# Altium schematic sheet Debug.SchDoc
size 420 x 297 mm; SheetNumber: 3; SheetTotal: 8
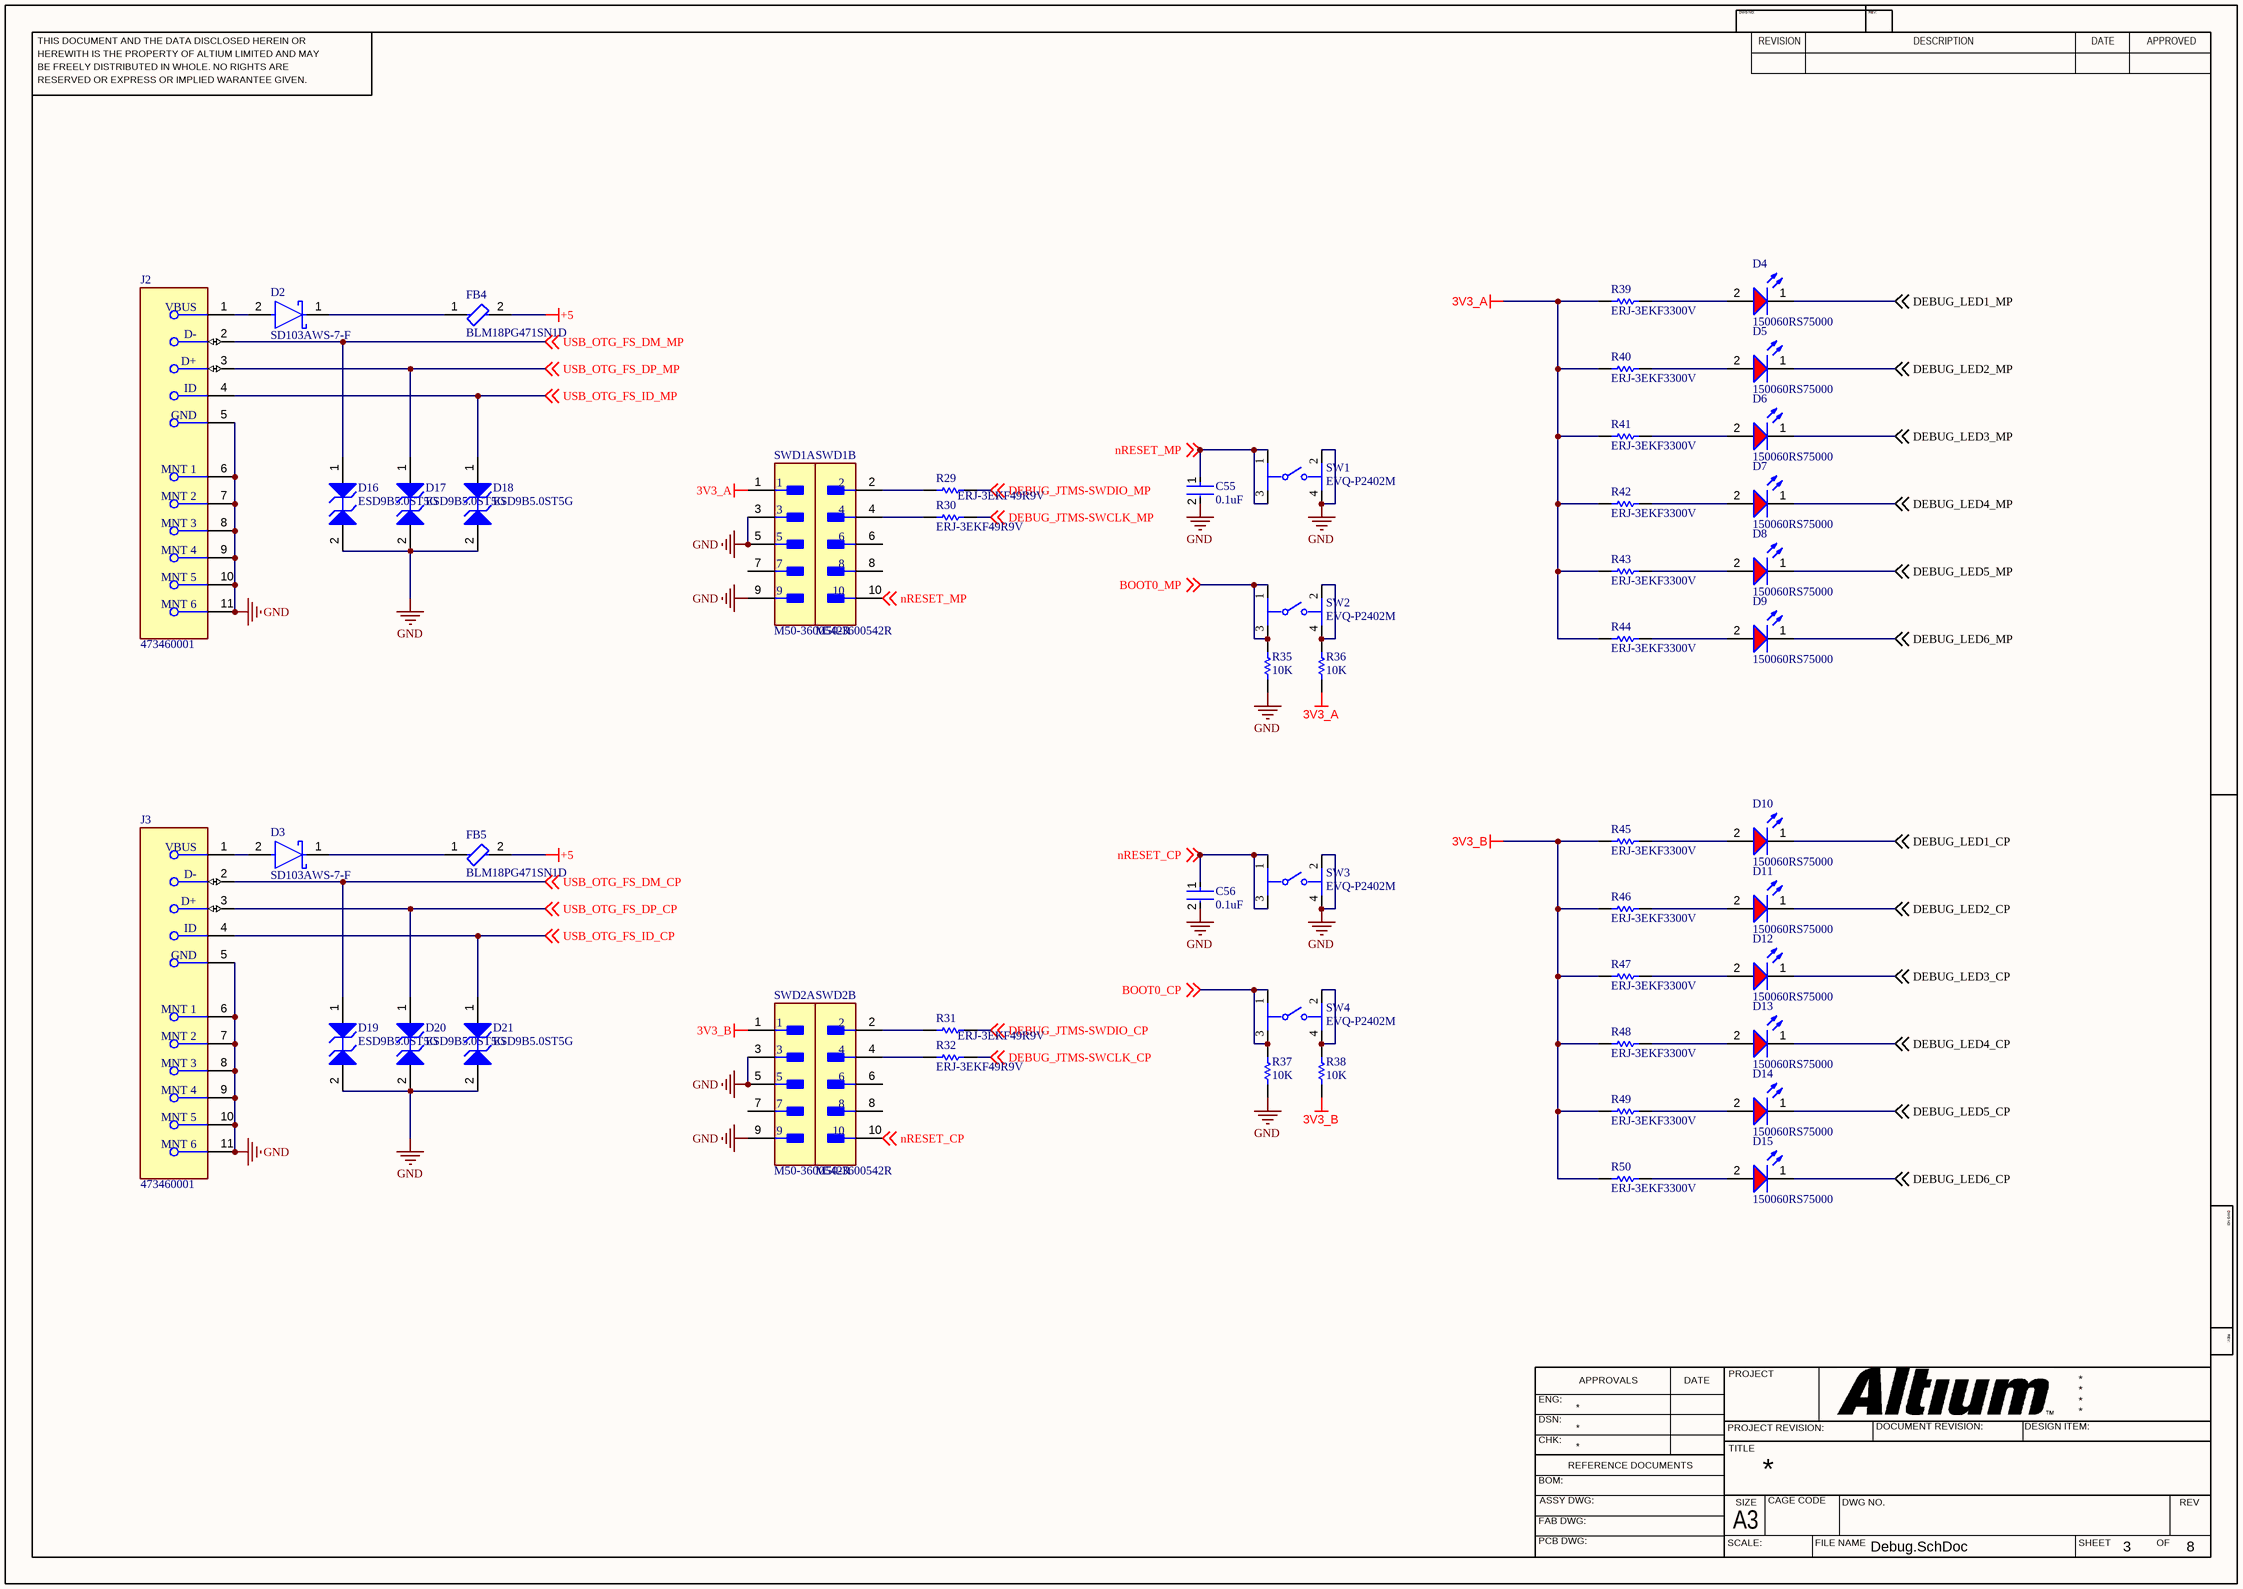
[diagram p0: Debug.SchDoc]

## Parts
C55  0.1uF  [FP-C0603C-CF-MFG]
C56  0.1uF  [FP-C0603C-CF-MFG]
D2  SD103AWS-7-F  [FP-SOD323-MFG]
D3  SD103AWS-7-F  [FP-SOD323-MFG]
D4  150060RS75000  [WL-SMCW_0603_150060xx75000]
D5  150060RS75000  [WL-SMCW_0603_150060xx75000]
D6  150060RS75000  [WL-SMCW_0603_150060xx75000]
D7  150060RS75000  [WL-SMCW_0603_150060xx75000]
D8  150060RS75000  [WL-SMCW_0603_150060xx75000]
D9  150060RS75000  [WL-SMCW_0603_150060xx75000]
D10  150060RS75000  [WL-SMCW_0603_150060xx75000]
D11  150060RS75000  [WL-SMCW_0603_150060xx75000]
D12  150060RS75000  [WL-SMCW_0603_150060xx75000]
D13  150060RS75000  [WL-SMCW_0603_150060xx75000]
D14  150060RS75000  [WL-SMCW_0603_150060xx75000]
D15  150060RS75000  [WL-SMCW_0603_150060xx75000]
D16  ESD9B5.0ST5G  [ONSC-SOD-923-2-514AB-01_V]
D17  ESD9B5.0ST5G  [ONSC-SOD-923-2-514AB-01_V]
D18  ESD9B5.0ST5G  [ONSC-SOD-923-2-514AB-01_V]
D19  ESD9B5.0ST5G  [ONSC-SOD-923-2-514AB-01_V]
D20  ESD9B5.0ST5G  [ONSC-SOD-923-2-514AB-01_V]
D21  ESD9B5.0ST5G  [ONSC-SOD-923-2-514AB-01_V]
FB4  BLM18PG471SN1D  [FP-BLM18-0_15-t0_8-MFG]
FB5  BLM18PG471SN1D  [FP-BLM18-0_15-t0_8-MFG]
J2  473460001  [FP-473460001-MFG]
J3  473460001  [FP-473460001-MFG]
R29  ERJ-3EKF49R9V  [RESC1608X55X30ML15T15]
R30  ERJ-3EKF49R9V  [RESC1608X55X30ML15T15]
R31  ERJ-3EKF49R9V  [RESC1608X55X30ML15T15]
R32  ERJ-3EKF49R9V  [RESC1608X55X30ML15T15]
R35  10K  [RESC1609X55X30LL15T15]
R36  10K  [RESC1609X55X30LL15T15]
R37  10K  [RESC1609X55X30LL15T15]
R38  10K  [RESC1609X55X30LL15T15]
R39  ERJ-3EKF3300V  [RESC1608X55X30LL15T15]
R40  ERJ-3EKF3300V  [RESC1608X55X30LL15T15]
R41  ERJ-3EKF3300V  [RESC1608X55X30LL15T15]
R42  ERJ-3EKF3300V  [RESC1608X55X30LL15T15]
R43  ERJ-3EKF3300V  [RESC1608X55X30LL15T15]
R44  ERJ-3EKF3300V  [RESC1608X55X30LL15T15]
R45  ERJ-3EKF3300V  [RESC1608X55X30LL15T15]
R46  ERJ-3EKF3300V  [RESC1608X55X30LL15T15]
R47  ERJ-3EKF3300V  [RESC1608X55X30LL15T15]
R48  ERJ-3EKF3300V  [RESC1608X55X30LL15T15]
R49  ERJ-3EKF3300V  [RESC1608X55X30LL15T15]
R50  ERJ-3EKF3300V  [RESC1608X55X30LL15T15]
SW1  EVQ-P2402M  [FP-EVQ-P2402M-MFG]
SW2  EVQ-P2402M  [FP-EVQ-P2402M-MFG]
SW3  EVQ-P2402M  [FP-EVQ-P2402M-MFG]
SW4  EVQ-P2402M  [FP-EVQ-P2402M-MFG]
SWD1  M50-3600542R  [FP-M50-3600542R-MFG]  (parts A,B of 2)
SWD2  M50-3600542R  [FP-M50-3600542R-MFG]  (parts A,B of 2)

## Nets
3V3_A: R36.1 R39.1 R40.1 R41.1 R42.1 R43.1 R44.1 SWD1.1
3V3_B: R38.1 R45.1 R46.1 R47.1 R48.1 R49.1 R50.1 SWD2.1
+5: FB4.2 FB5.2
GND: C55.2 C56.2 D16.2(A2) D17.2(A2) D18.2(A2) D19.2(A2) D20.2(A2) D21.2(A2) J2.5(GND) J2.6(MNT_1) J2.7(MNT_2) J2.8(MNT_3) J2.9(MNT_4) J2.10(MNT_5) J2.11(MNT_6) J3.5(GND) J3.6(MNT_1) J3.7(MNT_2) J3.8(MNT_3) J3.9(MNT_4) J3.10(MNT_5) J3.11(MNT_6) R35.1 R37.1 SW1.2 SW1.4 SW3.2 SW3.4 SWD1.3 SWD1.5 SWD1.9 SWD2.3 SWD2.5 SWD2.9
BOOT0_CP: R37.2 SW4.1 SW4.3 ; off-sheet BOOT0_CP
BOOT0_MP: R35.2 SW2.1 SW2.3 ; off-sheet BOOT0_MP
DEBUG_JTMS-SWCLK_CP: R32.2 ; off-sheet DEBUG_JTMS-SWCLK_CP
DEBUG_JTMS-SWCLK_MP: R30.2 ; off-sheet DEBUG_JTMS-SWCLK_MP
DEBUG_JTMS-SWDIO_CP: R31.2 ; off-sheet DEBUG_JTMS-SWDIO_CP
DEBUG_JTMS-SWDIO_MP: R29.2 ; off-sheet DEBUG_JTMS-SWDIO_MP
DEBUG_LED1_CP: D10.1(K) ; off-sheet DEBUG_LED1_CP
DEBUG_LED1_MP: D4.1(K) ; off-sheet DEBUG_LED1_MP
DEBUG_LED2_CP: D11.1(K) ; off-sheet DEBUG_LED2_CP
DEBUG_LED2_MP: D5.1(K) ; off-sheet DEBUG_LED2_MP
DEBUG_LED3_CP: D12.1(K) ; off-sheet DEBUG_LED3_CP
DEBUG_LED3_MP: D6.1(K) ; off-sheet DEBUG_LED3_MP
DEBUG_LED4_CP: D13.1(K) ; off-sheet DEBUG_LED4_CP
DEBUG_LED4_MP: D7.1(K) ; off-sheet DEBUG_LED4_MP
DEBUG_LED5_CP: D14.1(K) ; off-sheet DEBUG_LED5_CP
DEBUG_LED5_MP: D8.1(K) ; off-sheet DEBUG_LED5_MP
DEBUG_LED6_CP: D15.1(K) ; off-sheet DEBUG_LED6_CP
DEBUG_LED6_MP: D9.1(K) ; off-sheet DEBUG_LED6_MP
nRESET_CP: C56.1 SW3.1 SW3.3 SWD2.10 ; off-sheet nRESET_CP
nRESET_MP: C55.1 SW1.1 SW1.3 SWD1.10 ; off-sheet nRESET_MP
USB_OTG_FS_DM_CP: D19.1(A1) J3.2(D-) ; off-sheet USB_OTG_FS_DM_CP
USB_OTG_FS_DM_MP: D16.1(A1) J2.2(D-) ; off-sheet USB_OTG_FS_DM_MP
USB_OTG_FS_DP_CP: D20.1(A1) J3.3(D+) ; off-sheet USB_OTG_FS_DP_CP
USB_OTG_FS_DP_MP: D17.1(A1) J2.3(D+) ; off-sheet USB_OTG_FS_DP_MP
USB_OTG_FS_ID_CP: D21.1(A1) J3.4(ID) ; off-sheet USB_OTG_FS_ID_CP
USB_OTG_FS_ID_MP: D18.1(A1) J2.4(ID) ; off-sheet USB_OTG_FS_ID_MP
NetD2_1: D2.1(C) FB4.1
NetD2_2: D2.2(A) J2.1(VBUS)
NetD3_1: D3.1(C) FB5.1
NetD3_2: D3.2(A) J3.1(VBUS)
NetD4_2: D4.2(A) R39.2
NetD5_2: D5.2(A) R40.2
NetD6_2: D6.2(A) R41.2
NetD7_2: D7.2(A) R42.2
NetD8_2: D8.2(A) R43.2
NetD9_2: D9.2(A) R44.2
NetD10_2: D10.2(A) R45.2
NetD11_2: D11.2(A) R46.2
NetD12_2: D12.2(A) R47.2
NetD13_2: D13.2(A) R48.2
NetD14_2: D14.2(A) R49.2
NetD15_2: D15.2(A) R50.2
NetR29_1: R29.1 SWD1.2
NetR30_1: R30.1 SWD1.4
NetR31_1: R31.1 SWD2.2
NetR32_1: R32.1 SWD2.4
NetR36_2: R36.2 SW2.2 SW2.4
NetR38_2: R38.2 SW4.2 SW4.4

Not connected (* = marked no-connect by the designer): SWD1 6 7 8; SWD2 6 7 8

## Notes on the sheet
- THIS DOCUMENT AND THE DATA DISCLOSED HEREIN OR
- HEREWITH IS THE PROPERTY OF ALTIUM LIMITED AND MAY
- DWG NO:
- REVISION
- REV:
- DESCRIPTION
- DATE
- APPROVED
- BE FREELY DISTRIBUTED IN WHOLE. NO RIGHTS ARE
- RESERVED OR EXPRESS OR IMPLIED WARANTEE GIVEN.
- ENG:
- APPROVALS
- PROJECT
- DSN:
- CHK:
- REFERENCE DOCUMENTS
- PROJECT REVISION:
- TITLE
- DOCUMENT REVISION:
- DESIGN ITEM:
- BOM:
- FAB DWG:
- PCB DWG:
- ASSY DWG:
- SCALE:
- A3
- SIZE
- CAGE CODE
- FILE NAME
- DWG NO.
- SHEET
- OF
- REV

## Library data of the parts
C55 C56 = CMP-2006-03061-2: CAP CER 0.1UF 50V X7R 0603; Manufacturer: KEMET; Manufacturer Part Number: C0603C104K5RACTU; Tolerance: 0.1; Temperature Coefficient: 30ppm/°C; Material: Ceramic; Automotive Grade: Grade 1; Value: 0.10 μF; Temperature: -55°C to +125°C; RoHS: TRUE; Temperature Range High: +125°C; Lead Free: Yes; Octopart: https://octopart.com/c0603c104k5ractu-kemet-139244; Digikey Description: CAP CER 0.1UF 50V X7R 0603; Category: Cap; Package: C0603C-CF; ComponentLink2Description: Datasheet; Temperature Range Low: -55°C; Device Class L1: Passive Components; Voltage Rating: 50 V; Automotive: Yes; Device Class L3: Ceramic Capacitors; ComponentLink2URL: https://api.kemet.com/component-edge/download/datasheet/C0603C100J5GACAUTO.pdf; Capacitance: 0.10 μF; Device Class L2: Capacitors; Temperature Characteristic: X7R; Height: 0.87mm
D2 D3 = CMP-12790-000048-1: DIODE SCHOTTKY 40V 350MA SOD323; Manufacturer: Diodes Inc.; Max Surge Forward Current: 1.5A; Capacitance: 35pF; Peak Reverse Current: 5uA; Standoff Height: 0.05mm; Max Junction Temp: +125°C; Value: 35pF; Automotive Grade: Grade 1; ComponentLink2URL: https://www.diodes.com/assets/Datasheets/ds30101.pdf; Ipc Land Pattern Name: SOD250130X110-2; Octopart: https://octopart.com/sd103aws-7-f-diodes+inc.-55389602; Forward Current: 350mA; Device Class L1: Discrete Semiconductors; Lead Free: Yes; ComponentLink2Description: Datasheet; RoHS: TRUE; Temperature: -65°C to +125°C; Temperature Range Low: -65°C; Category: Diode; Package: SOD323; Digikey Description: DIODE SCHOTTKY 40V 350MA SOD323; Automotive: Yes; Device Class L2: Diodes; Mouser Description: Schottky Diodes & Rectifiers 40V 200mW; Manufacturer Part Number: SD103AWS-7-F; Device Class L3: Schottky Diodes; Max Repetitive Reverse Voltage: 40V; Footprint Url: https://www.diodes.com/assets/Package-Files/SOD323.pdf; Reverse Voltage: 40V; Temperature Range High: +125°C; Height: 1.2mm
D4-D15 = CMP-1426-00001-4: LED Low-Power Uni-Color Red 630nm 2V 2-Pin Chip 0603(1608Metric) T/R; Max Junction Temperature (Tj): 95°C; Dominant Wavelength: 625nm; Lens Style: Clear, Rectangular; Viewing Angle: 140°; Forward Current: 100mA; Max Reverse Voltage (DC): 5V; Luminous Intensity: 250mcd; Test Current: 20mA; Power Dissipation: 72mW; Max Operating Temperature: 85°C; Mount: Surface Mount; Height: 700µm; Packaging: Tape and Reel; REACH SVHC: Unknown; Case Code (Metric): 1608; Peak Wavelength: 630nm; Forward Voltage: 2V; Case/Package: 0603; Color: Red; RoHS: Compliant; Width: 800µm; Reverse Voltage: 5V; Min Operating Temperature: -40°C; Wavelength: 625nm; Case Code (Imperial): 0603; Length: 1.6mm
D16-D21 = CMP-1063-00119-1: Transient Voltage Suppressor, Micro-Packaged Diode for ESD Protection, 2-Pin SOD-923, Pb-Free, Tape and Reel; Manufacturer: On Semiconductor; Number of Lines: 1; Direction: Bidirectional; V(BR) Min (V): 5.8; VRWM Max (V): 5; Packing: Tape and Reel; PackageDescription: 2-Pin SOD, Body 0.8 x 0.6 mm; IR Max (uA): 1; ComponentLink3Description: Package Specification; PartNumber: ESD9B5.0ST5G; ComponentLink1URL: http://www.onsemi.com/; RoHS: Pb-Free; Mounting Technology: Surface Mount; DatasheetVersion: Rev. 2; ComponentLink2URL: http://www.onsemi.cn/pub_link/Collateral/ESD9B-D.PDF; ComponentLink3URL: http://www.onsemi.com/pub_link/Collateral/514AB.PDF; PackageReference: SOD-923-2-514AB-01; PackageVersion: Rev. C, 03/2011; ComponentLink1Description: Manufacturer URL; ComponentLink2Description: Datasheet
FB4 FB5 = CMP-0686-00587-3: Chip Ferrite Bead, 0603, 470Ω @ 100MHz, 0.2Ω, 25%, 1A; DC Resistance (DCR): 200mR; Number of Circuits: 1; Material: Steel; Impedance: 470R; Core Material: Ferrite; Width: 0.8mm; Termination: SMD/SMT; Series: BLM18P; Min Operating Temperature: -55°C; DC Resistance-Max: 200mR; Current Rating: 1A; Package Quantity: 1; Max Operating Temperature: 125°C; Military Standard: Not; REACH SVHC: No SVHC; Max Current Rating: 1A; Number of Pins: 2; RoHS Compliant: Yes; Tolerance: 25%; Packaging: Tape and Reel; Number of Lines: 1; Resistance: 200mR; Length: 1.6mm; Case Code (Metric): 1608; Depth: 0.8mm; Lead Free: Lead Free; Case/Package: 0603; Height: 0.8mm; Radiation Hardening: No; Test Frequency: 100MHz; Case Code (Imperial): 0603; Max DC Current: 1A; DC Current: 1A
J2 J3 = CMP-2000-05246-2: CONN RCPT USB2.0 MICRO B SMD R/A; Manufacturer: Molex; Conn Orientation: Right Angle; Is Female: yes; Shielding: true; Pitch: 0.65mm; Number Of Contacts: 5; Voltage Rating: 30V; Current Rating: 1.8A; Device Class L2: USB Connectors; Digikey Description: CONN RCPT USB2.0 MICRO B SMD R/A; Height: 2.945mm; RoHS: TRUE; ComponentLink2Description: Datasheet; Octopart: https://octopart.com/47346-0001-molex-7164928; Automotive: No; Package: 0; Category: Conn; Device Class L1: Connectors; Usb Standard: USB 2.0; Temperature: -30°C to +85°C; Temperature Range Low: -30°C; Footprint Url: https://www.molex.com/pdm_docs/sd/473460001_sd.pdf; ComponentLink2URL: https://www.molex.com/webdocs/datasheets/pdf/en-us/0473460001_IO_CONNECTORS.pdf; Lead Free: Yes; Manufacturer Part Number: 473460001; Contact Material: Gold,Nickel; Temperature Range High: +85°C; Device Class L3: unset
R29-R32 = CMP-2000-00538-1: Manufacturer: Panasonic; Part Number: ERJ-3EKF49R9V
R35-R38 = CMP-1012-00623-3: Chip Resistor, 10 KOhm, +/- 1%, 0.1 W, -55 to 155 degC, 0603 (1608 Metric), RoHS, Tape and Reel; Manufacturer: Panasonic; Voltage Rating: 75V; Case\/Package: 0603; Power Rating: 100mW; Resistance: 10KOhm; Temperature Coefficient: 100ppm\/degreesC; Number of Pins: 2; Package Reference: 603; Depth: 0.8mm; Mount: SurfaceMount; Package Description: 2-Pin Surface Mount Device, Body 1.6 x 0.85 mm; Datasheet Version: 02/2017; Length: 1.6mm; Lead Free: LeadFree; Height: 0.45mm; Number of Terminations: 2; Max Power Dissipation: 100mW; Min Operating Temperature: -55degC; Datasheet URL: https://industrial.panasonic.com/cdbs/www-data/pdf/RDA0000/AOA0000C304.pdf; Termination: SMD/SMT; Case Code (Metric): 1608; Case Code (Imperial): 0603; Tolerance: 1%; Max Operating Temperature: 155degC; RoHSCompliant: true; Voltage Rating (DC): 75V; Radiation Hardening: No; Packaging: TapeandReel; Composition: ThickFilm; Mounting Technology: SurfaceMount; Manufacturer URL: http://www.panasonic.com/; Width: 0.031inch; REACH SVHC: NoSVHC; Contact Plating: Tin; Military Standard: Not; Package Quantity: 1
R39-R50 = CMP-2000-00435-2: Chip Resistor, 330 Ohm, +/- 1%, 0.1 W, -55 to 155 degC, 0603 (1608 Metric), RoHS, Tape and Reel; Gender: Male; Mating Cycles: 10000; Current Rating: 500 mA; Voltage Rating: 10 V; REACH SVHC: No SVHC; PackageDescription: 2-Pin Surface Mount Device, Body 1.6 x 0.85 mm; Contact Finish: Gold; Pins: 8; ComponentLink1Description: Manufacturer URL; Packaging: Tape and Reel; Max Operating Temperature: 85 degC; Contact Material: Copper; Height: 1.45 mm; Width: 1.45 mm; DatasheetVersion: Apr-15; Package Quantity: 1500; Contact Plating: Gold; PackageReference: 0603; Mount: Surface Mount; Lead Pitch: 1.1 mm; Min Operating Temperature: -25 degC; ComponentLink1URL: http://www.panasonic.com/; ComponentLink2URL: http://industrial.panasonic.com/cdbs/www-data/pdf/RDA0000/AOA0000C86.pdf; Length: 13.7 mm; ComponentLink2Description: Datasheet; RoHSCompliant: true
SW1-SW4 = CMP-05618-000087-1: SWITCH TACTILE SPST-NO 0.02A 15V; Mechanical Life: 500000Cycles; Contact Resistance: 100mR; Max Current Rating: 20mA; Throw Configuration: SPST; Switch Function: Off-Mom; Illumination Type: Non-Illuminated; Actuator Color: Natural; Operating Force: 2.4N; Actuator Length: 0.45mm; Switch Travel: 0.25mm; Color: Clear; Size: 3.5mm; Radiation Hardening: No; Mount: Surface Mount; Package Quantity: 1; Length: 3.5mm; Height: 2.1mm; Series: EVQP2; Contact Current Rating: 20mA; Termination: J-Bend; Electrical Life: 500000Cycles; Packaging: Tape and Reel; Current Rating: 20mA; Max Operating Temperature: 85°C; Orientation: Straight; Width: 3.5mm; Max Voltage Rating (DC): 15V; RoHS Compliant: Yes; REACH SVHC: No SVHC; Min Operating Temperature: -40°C; Depth: 5.5mm; Voltage Rating (DC): 15V; Lead Free: Lead Free
SWD1 SWD2 = CMP-15831-000038-1: CONN HEADER SMD 10POS 1.27MM; Number of Contacts: 10; Max Current Rating: 1A; Gender: Male; Contact Resistance: 30mR; Radiation Hardening: No; RoHS Compliant: Yes; Length: 6.35mm; Max Operating Temperature: 105°C; Termination: Solder; Contact Plating: Gold; Number of Rows: 2; Pitch: 1.27mm; Housing Material: Thermoplastic; Depth: 3.41mm; Orientation: Straight; Contact Material: Copper Alloy; Min Operating Temperature: -40°C